# Altium schematic sheet Sheet1.SchDoc
size B; SheetNumber: 1; SheetTotal: 2
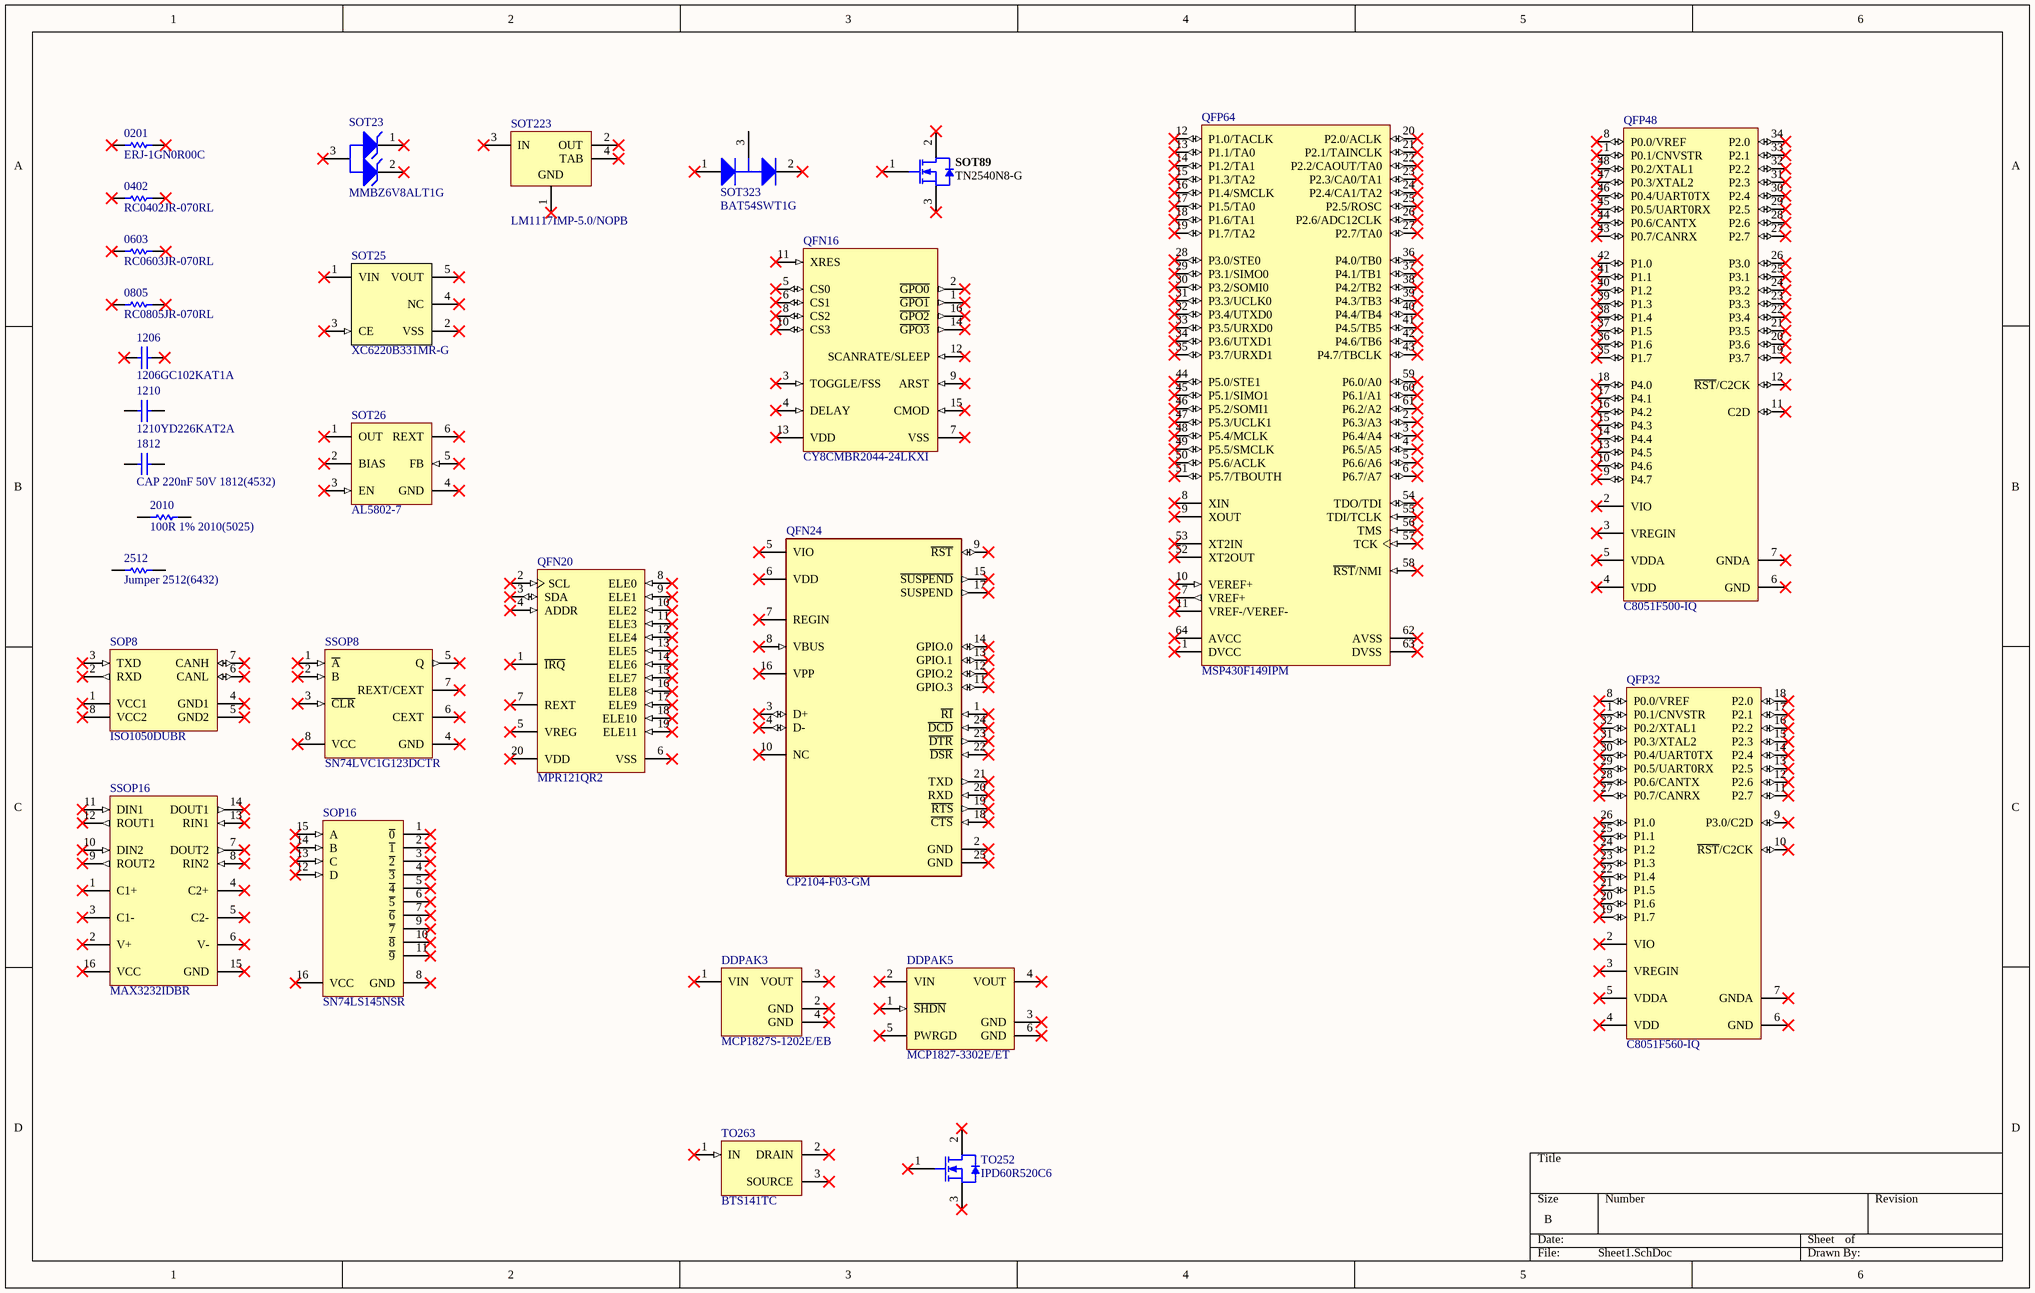
[diagram p0: Sheet1.SchDoc]

## Parts
0201  ERJ-1GN0R00C  [RESC0603X26X15LL03T05]
0402  RC0402JR-070RL  [RESC1005X40X25NL05T10]
0603  RC0603JR-070RL  [RESC1608X55X25ML10T15]
0805  RC0805JR-070RL  [RESC2013X60X35ML10T20]
1206  1206GC102KAT1A  [AVX-1206-2_L]
1210  1210YD226KAT2A  [CAPC3225X279X50LL20T25]
1812  CAP 220nF 50V 1812(4532)  [CAPC1812(4532)190_N]
2010  100R 1% 2010(5025)  [RESC2010(5025)_N]
2512  Jumper 2512(6432)  [RESC2512(6432)_L]
DDPAK3  MCP1827S-1202E/EB  [DDPAK-EB3_M]
DDPAK5  MCP1827-3302E/ET  [DDPAK-ET5_M]
QFN16  CY8CMBR2044-24LKXI  [CYP-LKX16_L]
QFN20  MPR121QR2  [FREE-QFN-20_L]
QFN24  CP2104-F03-GM  [FP-CP2104-F03-GM-MFG]
QFP32  C8051F560-IQ  [LQFP-32_L]
QFP48  C8051F500-IQ  [QFP-48_M]
QFP64  MSP430F149IPM  [PM0064A_M]
SOP8  ISO1050DUBR  [DUB0008A_L]
SOP16  SN74LS145NSR  [NS0016A_M]
SOT23  MMBZ6V8ALT1G  [ONSC-SOT-23-3-318-08_V]
SOT25  XC6220B331MR-G  [TORX-SOT-25-5_M]
SOT26  AL5802-7  [DIOD-SOT26-6_V]
SOT89  TN2540N8-G  [MCHP-TO-243AA_N8_L]
SOT223  LM1117IMP-5.0/NOPB  [DCY0004A_M]
SOT323  BAT54SWT1G  [ONSC-SOT-323-3-419-04_V]
SSOP8  SN74LVC1G123DCTR  [DCT0008A_N]
SSOP16  MAX3232IDBR  [DB0016A_M]
TO252  IPD60R520C6  [INF-PG-TO252-3-313_M]
TO263  BTS141TC  [INF-PG-TO263-3-2_L]

## Nets

Not connected (* = marked no-connect by the designer): 0201 1* 2*; 0402 1* 2*; 0603 1* 2*; 0805 1* 2*; 1206 1* 2*; 1210 1 2; 1812 1 2; 2010 1 2; 2512 1 2; DDPAK3 1(VIN)* 2(GND)* 3(VOUT)* 4(GND)*; DDPAK5 1(~{SHDN})* 2(VIN)* 3(GND)* 4(VOUT)* 5(PWRGD)* 6(GND)*; QFN16 1(~{GPO1})* 2(~{GPO0})* 3(TOGGLE/FSS)* 4(DELAY)* 5(CS0)* 6(CS1)* 7(VSS)* 8(CS2)* 9(ARST)* 10(CS3)* 11(XRES)* 12(SCANRATE/SLEEP)* 13(VDD)* 14(~{GPO3})* 15(CMOD)* 16(~{GPO2})*; QFN20 1(~{IRQ})* 2(SCL)* 3(SDA)* 4(ADDR)* 5(VREG)* 6(VSS)* 7(REXT)* 8(ELE0)* 9(ELE1)* 10(ELE2)* 11(ELE3)* 12(ELE4)* 13(ELE5)* 14(ELE6)* 15(ELE7)* 16(ELE8)* 17(ELE9)* 18(ELE10)* 19(ELE11)* 20(VDD)*; QFN24 1(~{RI})* 2(GND)* 3(D+)* 4(D-)* 5(VIO)* 6(VDD)* 7(REGIN)* 8(VBUS)* 9(~{RST})* 10(NC)* 11(GPIO.3)* 12(GPIO.2)* 13(GPIO.1)* 14(GPIO.0)* 15(~{SUSPEND})* 16(VPP)* 17(SUSPEND)* 18(~{CTS})* 19(~{RTS})* 20(RXD)* 21(TXD)* 22(~{DSR})* 23(~{DTR})* 24(~{DCD})* 25(GND)*; QFP32 1(P0.1/CNVSTR)* 2(VIO)* 3(VREGIN)* 4(VDD)* 5(VDDA)* 6(GND)* 7(GNDA)* 8(P0.0/VREF)* 9(P3.0/C2D)* 10(~{RST}/C2CK)* 11(P2.7)* 12(P2.6)* 13(P2.5)* 14(P2.4)* 15(P2.3)* 16(P2.2)* 17(P2.1)* 18(P2.0)* 19(P1.7)* 20(P1.6)* 21(P1.5)* 22(P1.4)* 23(P1.3)* 24(P1.2)* 25(P1.1)* 26(P1.0)* 27(P0.7/CANRX)* 28(P0.6/CANTX)* 29(P0.5/UART0RX)* 30(P0.4/UART0TX)* 31(P0.3/XTAL2)* 32(P0.2/XTAL1)*; QFP48 1(P0.1/CNVSTR)* 2(VIO)* 3(VREGIN)* 4(VDD)* 5(VDDA)* 6(GND)* 7(GNDA)* 8(P0.0/VREF)* 9(P4.7)* 10(P4.6)* 11(C2D)* 12(~{RST}/C2CK)* 13(P4.5)* 14(P4.4)* 15(P4.3)* 16(P4.2)* 17(P4.1)* 18(P4.0)* 19(P3.7)* 20(P3.6)* 21(P3.5)* 22(P3.4)* 23(P3.3)* 24(P3.2)* 25(P3.1)* 26(P3.0)* 27(P2.7)* 28(P2.6)* 29(P2.5)* 30(P2.4)* 31(P2.3)* 32(P2.2)* 33(P2.1)* 34(P2.0)* 35(P1.7)* 36(P1.6)* 37(P1.5)* 38(P1.4)* 39(P1.3)* 40(P1.2)* 41(P1.1)* 42(P1.0)* 43(P0.7/CANRX)* 44(P0.6/CANTX)* 45(P0.5/UART0RX)* 46(P0.4/UART0TX)* 47(P0.3/XTAL2)* 48(P0.2/XTAL1)*; QFP64 1(DVCC)* 2(P6.3/A3)* 3(P6.4/A4)* 4(P6.5/A5)* 5(P6.6/A6)* 6(P6.7/A7)* 7(VREF+)* 8(XIN)* 9(XOUT)* 10(VEREF+)* 11(VREF-/VEREF-)* 12(P1.0/TACLK)* 13(P1.1/TA0)* 14(P1.2/TA1)* 15(P1.3/TA2)* 16(P1.4/SMCLK)* 17(P1.5/TA0)* 18(P1.6/TA1)* 19(P1.7/TA2)* 20(P2.0/ACLK)* 21(P2.1/TAINCLK)* 22(P2.2/CAOUT/TA0)* 23(P2.3/CA0/TA1)* 24(P2.4/CA1/TA2)* 25(P2.5/ROSC)* 26(P2.6/ADC12CLK)* 27(P2.7/TA0)* 28(P3.0/STE0)* 29(P3.1/SIMO0)* 30(P3.2/SOMI0)* 31(P3.3/UCLK0)* 32(P3.4/UTXD0)* 33(P3.5/URXD0)* 34(P3.6/UTXD1)* 35(P3.7/URXD1)* 36(P4.0/TB0)* 37(P4.1/TB1)* 38(P4.2/TB2)* 39(P4.3/TB3)* 40(P4.4/TB4)* 41(P4.5/TB5)* 42(P4.6/TB6)* 43(P4.7/TBCLK)* 44(P5.0/STE1)* 45(P5.1/SIMO1)* 46(P5.2/SOMI1)* 47(P5.3/UCLK1)* 48(P5.4/MCLK)* 49(P5.5/SMCLK)* 50(P5.6/ACLK)* 51(P5.7/TBOUTH)* 52(XT2OUT)* 53(XT2IN)* 54(TDO/TDI)* 55(TDI/TCLK)* 56(TMS)* 57(TCK)* 58(~{RST}/NMI)* 59(P6.0/A0)* 60(P6.1/A1)* 61(P6.2/A2)* 62(AVSS)* 63(DVSS)* 64(AVCC)*; SOP8 1(VCC1)* 2(RXD)* 3(TXD)* 4(GND1)* 5(GND2)* 6(CANL)* 7(CANH)* 8(VCC2)*; SOP16 1(~{0})* 2(~{1})* 3(~{2})* 4(~{3})* 5(~{4})* 6(~{5})* 7(~{6})* 8(GND)* 9(~{7})* 10(~{8})* 11(~{9})* 12(D)* 13(C)* 14(B)* 15(A)* 16(VCC)*; SOT23 1(K1)* 2(K2)* 3(A)*; SOT25 1(VIN)* 2(VSS)* 3(CE)* 4(NC)* 5(VOUT)*; SOT26 1(OUT)* 2(BIAS)* 3(EN)* 4(GND)* 5(FB)* 6(REXT)*; SOT89 1(G)* 2(D)* 3(S)*; SOT223 1(GND)* 2(OUT)* 3(IN)* 4(TAB)*; SOT323 1(A)* 2(K)* 3(K/A); SSOP8 1(~{A})* 2(B)* 3(~{CLR})* 4(GND)* 5(Q)* 6(CEXT)* 7(REXT/CEXT)* 8(VCC)*; SSOP16 1(C1+)* 2(V+)* 3(C1-)* 4(C2+)* 5(C2-)* 6(V-)* 7(DOUT2)* 8(RIN2)* 9(ROUT2)* 10(DIN2)* 11(DIN1)* 12(ROUT1)* 13(RIN1)* 14(DOUT1)* 15(GND)* 16(VCC)*; TO252 1(GATE)* 2(DRAIN)* 3(SOURCE)*; TO263 1(IN)* 2(DRAIN)* 3(SOURCE)*

## Library data of the parts
0201 = CMP-1010-00001-2: Manufacturer: Panasonic; Part Number: ERJ-1GN0R00C
0402 = CMP-1011-00001-2: Manufacturer: Yageo / Phycomp; Part Number: RC0402JR-070RL
0603 = CMP-2100-03667-1: Chip Resistor, 0 Ohm, +/- 5%, 0.1 W, -55 to 155 degC, 0603 (1608 Metric), RoHS, Tape and Reel; Manufacturer: Yageo; Temperature Coefficient: 200ppm/degreesC; Voltage Rating: 50V; Power Rating: 100mW; Resistance: 0mOhm; Width: 0.8mm; Max Operating Temperature: 155degC; Tolerance: 5%; Package Reference: 0603; Height: 0.45mm; Depth: 0.8mm; Package Description: 2-Pin Surface Mount Device, Body 1.6 x 0.8 mm; Termination: SMD/SMT; Package Quantity: 5000; Case/Package: 0603; Case Code (Imperial): 0603; Radiation Hardening: No; Number of Pins: 2; Length: 1.6mm; Lead Free: LeadFree; Voltage Rating (DC): 50V; Military Standard: Not; Datasheet URL: http://www.yageo.com/NewPortal/yageodocoutput?fileName=/pdf/R-Chip/PYu-RC_Group_51_RoHS_L_5.pdf; Manufacturer URL: http://www.yageo.com/; Packaging: TapeandReel; Case Code (Metric): 1608; Min Operating Temperature: -55degC; Composition: ThickFilm; RoHSCompliant: true; Contact Plating: Tin; Datasheet Version: Rev. 5, 10/2016; REACH SVHC: NoSVHC
0805 = CMP-2100-03673-1: Chip Resistor, 0 Ohm, Jumper, +/- 5%, 0.125 W, -55 to 155 degC, 0805 (2012 Metric), RoHS, Tape and Reel; Manufacturer: Yageo; Power Rating: 125mW; Resistance: 0mOhm; Voltage Rating (DC): 150V; Temperature Coefficient: 200ppm/degreesC; Height: 0.5mm; Depth: 1.25mm; Case Code (Imperial): 0805; Lead Free: LeadFree; Military Standard: Not; Package Description: 2-Pin Surface Mounted Device, Body 2 x 1.25 mm; Case Code (Metric): 2012; Composition: ThickFilm; Voltage Rating: 150V; Manufacturer URL: http://www.yageo.com/; Packaging: TapeandReel; Package Reference: 0805; REACH SVHC: Unknown; Tolerance: 5%; Case/Package: 0805; Max Operating Temperature: 155degC; Number of Pins: 2; Min Operating Temperature: -55degC; RoHSCompliant: true; Length: 2mm; Datasheet URL: http://www.yageo.com/NewPortal/yageodocoutput?fileName=/pdf/R-Chip/PYu-RC_Group_51_RoHS_L_5.pdf; Termination: SMD/SMT; Radiation Hardening: No; Width: 1.25mm; Contact Plating: Tin; Datasheet Version: Rev. 5, 10/2016
1206 = CMP-2000-05468-1: Chip Capacitor, 1 nF, +/- 10%, -55 to 125 degC, 1206 (3216 Metric), RoHS, Tape and Reel; Manufacturer: AVX; Capacitance: 0.001uF; Dielectric: X7R; Voltage Rating DC: 2000V; Package Reference: 1206; Datasheet Version: 11/2010; Mounting Technology: SurfaceMount; Manufacturer URL: http://www.avx.com/; Tolerance: 10%; Tolerance (%): ±10%; PartNumber: 1206GC102KAT1A; Datasheet URL: https://datasheet.ciiva.com/11787/0900766b80ed4c37-11787781.pdf; Package Description: 2-Pin SMD, Body 3.4 x 1.8 mm; Case Size/Dimension: 1206; Rated Voltage: 2000V
1210 = CMP-2000-05483-1: Chip Capacitor, 22 uF, +/- 10%, 16 V, -55 to 85 degC, 1210 (3225 Metric), RoHS, Tape and Reel; Manufacturer: AVX; Rated Voltage: 16V; Dielectric: X5R; Capacitance: 22µF; Tolerance (%): ±10%; Datasheet Version: 05/2016; Case Size/Dimension: 1210; Package Reference: 1210; Package Description: 2-Pin Surface Mount Device, Body 3.2 x 2.5 mm; Mounting Technology: SurfaceMount; Manufacturer URL: http://www.avx.com/; Datasheet URL: http://datasheets.avx.com/cx5r.pdf
1812 = CMP-1040-01438-1: CAP 220nF 50V ±10% 1812 (4532 Metric) Thickness 1.9mm SMD; Tolerance: Â±10%; Case-Metric: 4532; Case-EIA: 1812; Max Thickness: 1.9 mm; Technology: SMT; Value: 220nF; Rated Voltage: 50 V
2010 = CMP-1017-00397-1: 100R 0.75W 1% 2010 (5025 Metric)  SMD; Case-EIA: 2010; Case-Metric: 5025; Value: 100.00 Ohm; Tolerance: 1 %; Power: 0.75 W; Technology: SMT
2512 = CMP-1018-00001-1: Jumper 2512 (6432 Metric); Tolerance: None; Case-EIA: 2512; Value: 0.00 Ohm; Case-Metric: 6432; Technology: SMT; Power: None
DDPAK3 = CMP-0136-00060-1: 1.5A, Low Voltage, Low Quiescent Current LDO Regulator, 3-Pin DDPAK, Extended Temperature; PackageDescription: 3-Lead Plastic (EB) [DDPAK]; PackageReference: DDPAK-EB3; PackageVersion: revBB, Aug-2009; DatasheetVersion: revC, Feb-2007
DDPAK5 = CMP-0136-00037-1: 1.5A, Low Voltage, Low Quiescent Current LDO Regulator, 5-Pin DDPAK, Extended Temperature; PackageDescription: 5-Lead Plastic (ET) [DDPAK]; DatasheetVersion: revC, Feb-2007; PackageVersion: revBB, Aug-2009; PackageReference: DDPAK-ET5
QFN16 = CMP-0374-00015-2: Four Button CapSense Controller, 4 CapSense IO, 1.71 to 5.50 V, 16-Pin QFN (LKX16); Manufacturer: Cypress; Comm. Interface: GPO; Min. Operating Voltage (V): 1.71; Rating: I; No. of GPIOs: 4; Proximity Sensing: N; SmartSense Enabled: Y; Packing: Tray; Max. Operating Voltage (V): 5.5; Code_JEDEC: MO-220; PackageReference: LKX16; ComponentLink2URL: http://www.cypress.com/?docID=45011; PackageVersion: *E; ComponentLink4URL: http://www.cypress.com/?rID=45569; Mounting Technology: Surface Mount; ComponentLink1URL: http://www.cypress.com/; DatasheetVersion: Rev. *G; ComponentLink1Description: Manufacturer URL; Min. Operating Temp. (Â°C): -40; No. of CapSense IO: 4; ComponentLink4Description: Product URL; ComponentLink3URL: http://www.cypress.com/?docID=39689; PWMs: N; Max. Operating Temp. (Â°C): 85; RoHS: Pb-Free; PartNumber: CY8CMBR2044-24LKXI; PackageDescription: 16-Pin Chip on Lead Sawn QFN, Body 3 X 3 mm, Pitch 0.5 mm; ComponentLink2Description: Datasheet; ComponentLink3Description: Package Specification
QFN20 = CMP-1750-00004-1: Proximity Capacitive Touch Sensor Controller, 1.71 to 3.6 V, -40 to 85 degC, 20-Pin QFN, RoHS, Tape and Reel; Current Rating: 2 A; Voltage Rating: 750 V; PackageDescription: 20-Pin Quad Flat No-lead Package, Body 3 x 3 mm, Pitch 0.4 mm; ComponentLink1URL: http://www.nxp.com/; Radiation Hardening: No; RoHSCompliant: True; Package Quantity: 22; Height: 8.64 mm; Min Operating Temperature: -65degC; Max Operating Temperature: 105degC; Mount: Through Hole; ComponentLink1Description: Manufacturer URL; Lead Pitch: 2.54 mm; Width: 3.56 mm; DatasheetVersion: Rev. 4, 02/2013; Length: 25.4 mm; Colour: Black; Pins: 10; Contact Finish: Gold; ComponentLink2Description: Datasheet; Packaging: Rail/Tube; Contact Plating: Gold; ComponentLink2URL: http://www.nxp.com/files/sensors/doc/data_sheet/MPR121.pdf; PackageReference: QFN-20; Contact Material: Bronze
QFN24 = CMP-0511-00004-2: IC SGL USB-TO-UART BRIDGE 24QFN; Number of Transceivers: 1; Max Supply Voltage: 3.6V; Operating Supply Current: 17mA; Operating Supply Voltage: 3.3V; Data Rate: 2Mbps; Min Supply Voltage: 3V; Number of Channels: 1; Max Operating Temperature: 85°C; Contact Plating: Tin; Min Operating Temperature: -40°C; Number of Pins: 24; Case/Package: QFN; Packaging: Rail/Tube; Radiation Hardening: No; Weight: 0.001764oz
QFP32 = CMP-0230-00164-1: Mixed Signal 32KB Flash ISP MCU, 2304B RAM, 25 I/Os, 12-Bit 25 Channel ADC, CAN 2.0, LIN 2.1, 32-Pin QFP, Industrial Grade; PackageVersion: 2007; ComponentLink2URL: http://www.silabs.com/Support%20Documents/TechnicalDocs/C8051F55x-F56x-F57x.pdf; ComponentLink2Description: Datasheet; DatasheetVersion: rev1.1, 2011; ComponentLink1Description: Manufacturer Link; PackageDescription: 32-Pin Thin Quad Flat Pack, 7 x 7 x 1.4 mm Body, 0.8 mm Pitch; PackageReference: LQFP-32; ComponentLink1URL: http://www.silabs.com
QFP48 = CMP-0230-00134-1: Mixed Signal 64KB ISP Flash MCU, 4352B RAM, 40 I/Os, 12-Bit 32 Channel ADC, Can 2.0B, LIN 2.0, Ext Mem, 48-Pin QFP, Industrial Grade; Code_JEDEC: MS-026-ABC; DatasheetVersion: rev1.2, Mar-2011; ComponentLink1Description: Manufacturer Link; ComponentLink1URL: http://www.silabs.com; ComponentLink2Description: Datasheet; PackageDescription: 48-Pin Thin Quad Flat Pack, 7 x 7 x 1 mm Body, 0.5 mm Pitch; ComponentLink2URL: http://www.silabs.com/Support%20Documents/TechnicalDocs/C8051F50x-51x.pdf; PackageReference: QFP-48; PackageVersion: 2011
QFP64 = CMP-0365-00282-2: 8 MHz Mixed Signal Microcontroller with 60 KB Flash, 2048 B SRAM and 48 GPIOs, -40 to 85 degC, 64-pin QFP (PM), Green (RoHS & no Sb/Br); Manufacturer: Texas Instruments; USART: 2; SubFamily: 1 Series; ADC: 12-bit SAR; SRAM(B): 2048; Frequency(MHz): 8; GPIO: 48; Flash(KB): 60; Watchdog: Yes; Multiplier: 16x16; PackageDescription: 64-Pin Plastic Quad Flat Pack, Body 10 x 10 mm, Pitch 0.5 mm; Eco-Plan: Green (RoHS & no Sb/Br); ComponentLink1URL: http://www.ti.com/; PartNumber: MSP430F149IPM; ComponentLink3URL: http://www.ti.com/lit/ml/mtqf008a/mtqf008a.pdf; ComponentLink1Description: Manufacturer URL; ComponentLink2URL: http://www.ti.com/general/docs/lit/getliterature.tsp?genericPartNumber=MSP430F149&fileType=pdf; Mounting Technology: Surface Mount; ADC Channels: 8; Timers - 16-bit: 2; DatasheetVersion: SLAS272F; Code_JEDEC: MS-026; PackageReference: PM0064A; Comparators: Yes; ComponentLink2Description: Datasheet; Temp Sensor: Yes; PackageVersion: 4040152/C; ComponentLink3Description: Package Specification
SOP8 = CMP-0315-00093-2: Isolated CAN Transceiver, -55 to 105 degC, 8-pin SOP (DUB), Green (RoHS & no Sb/Br); Manufacturer: Texas Instruments; Rating: Catalog; Isolated: Yes; Drivers Per Package: 1; PackageReference: DUB0008A; PartNumber: ISO1050DUBR; ComponentLink2Description: Package Specification; ComponentLink1Description: Datasheet; Mounting Technology: Surface Mount; ComponentLink1URL: http://www.ti.com/general/docs/lit/getliterature.tsp?genericPartNumber=ISO1050&fileType=pdf; ComponentLink2URL: http://www.ti.com/litv/pdf/mpds247b; Eco-Plan: Green (RoHS & no Sb/Br); PackageDescription: 8-Pin Small Outline Package 2.54 mm Pitch; PackageVersion: revC, May-2006; SubFamily: CAN; DatasheetVersion: SLLS983E
SOP16 = CMP-1633-00758-2: BCD-To-Decimal Decoders/Drivers, NS0016A, LARGE T&R; Manufacturer: Texas Instruments; VCC(Min)(V): 4.75; VCC(Max)(V): 5.25; Function: Decoder/Demultiplexer; F @ Nom Voltage(Max)(Mhz): 35; Rating: Catalog; Configuration: 4：10; ICC @ Nom Voltage(Max)(mA): 13; tpd @ Nom Voltage(Max)(ns): 50; Voltage(Nom)(V): 5; Output Drive (IOL/IOH)(Max)(mA): 80/-20; Input Type: TTL; Schmitt Trigger: No; Bits(#): 10; Channels(#): 1; Technology Family: LS; Type: Standard; PackageReference: NS0016A; DatasheetVersion: SDLS051; Operating Temperature Range(C): 0 to 70; Generic Part Number: SN74LS145; Output Type: TTL
SOT23 = CMP-1061-00654-1: 40 W Peak Power Zener Transient Voltage Suppressor, Dual Common Anode Zeners for ESD Protection, 3-Pin SOT-23, Pb-Free, Tape and Reel; Manufacturer: On Semiconductor; V(BR) Typ (V): 6.8; IR Max (uA): 0.5; PPK Max (W): 24; Direction: Unidirectional; PartNumber: MMBZ6V8ALT1G; PackageReference: SOT-23-3-318-08; RoHS: Pb-Free; ComponentLink2URL: http://www.onsemi.com/pub_link/Collateral/MMBZ5V6ALT1-D.PDF; PackageVersion: Rev. AP, 11/2009; DatasheetVersion: Rev. 13; Packing: Tape and Reel; ComponentLink3Description: Package Specification; ComponentLink3URL: http://www.onsemi.cn/pub_link/Collateral/318-08.PDF; ComponentLink1URL: http://www.onsemi.com/; Mounting Technology: Surface Mount; ComponentLink1Description: Manufacturer URL; PackageDescription: 3-Pin Small Outline Transistor, Body 2.92 x 1.3 mm, Pitch 0.95 mm; ComponentLink2Description: Datasheet
SOT25 = CMP-0599-00001-2: 1A LDO Voltage Regulator with CL discharge, 3.3 V, 1000 mA, -45 to 85 degC, 5-Pin SOT-25, RoHS, Reel; Manufacturer: Torex; Output Voltage: 3.3 V; Maximum Output Current: 1000 mA; ComponentLink1Description: Manufacturer URL; ComponentLink2URL: http://www.torex.co.jp/english/products/voltage_regulators/data/XC6220.pdf; DatasheetVersion: ETR0341-010a; ComponentLink1URL: http://www.torex.co.jp/; Mounting Technology: Surface Mount; Operating Ambient Temperature: -40 to 85 degC; PackageReference: SOT-25-5; PackageDescription: 5-Pin Small Out-Line Transistor, Body 2.9 x 1.65 mm, Pitch 0.95 mm; PartNumber: XC6220B331MR-G; RoHS: TRUE; Packing: Reel; ComponentLink2Description: Datasheet
SOT26 = CMP-2000-05770-1: Adjustable Current Sink Linear LED Driver, 30 V, -40 to 125 degC, 6-Pin SOT23 (SOT26), RoHS, Tape and Reel; Manufacturer: DiodesIncorporated; Input Voltage: 4.5Vto30V; Pd - Power Dissipation: 1W; Unit Weight: 0.001058oz; Datasheet Version: Rev. 6-2, 12/2012; Package Reference: SOT26-6; Brand: DiodesIncorporated; Factory Pack Quantity: 3000; Package Description: 6-Pin Small Outline Transistor, Body 1.6 x 3 mm, Pitch 0.95 mm; Manufacturer URL: http://www.diodes.com/; Datasheet URL: https://datasheet.ciiva.com/15224/getdatasheetpartid-661227-15224070.pdf; RoHS: True; Series: AL580; Mounting Style: SMD/SMT; Product Category: LEDLightingDrivers; Mounting Technology: SurfaceMount; Minimum Operating Temperature: -40C; Packaging: Reel; Maximum Operating Temperature: +125C; Package / Case: SOT-26
SOT89 = CMP-2000-07270-1: N-Channel Enhancement-Mode Vertical DMOS FET, 2 V, 1 A, 12 Ohm, -55 to 150 degC, 3-Pin SOT-89, RoHS, Tape and Reel; Manufacturer: Microchip; Transistor Type: 1N-Channel; Number of Channels: 1Channel; Typical Turn-Off Delay Time: 25ns; Configuration: Single; Rise Time: 15ns; Vds - Drain-Source Breakdown Voltage: 400V; Brand: MicrochipTechnology; Typical Turn-On Delay Time: 20ns; Vgs - Gate-Source Voltage: 20V; Pd - Power Dissipation: 1.6W; Id - Continuous Drain Current: 260mA; Unit Weight: 0.001862oz; Rds On - Drain-Source Resistance: 12Ohms; Product Category: MOSFET; Package Description: 3-Piin Small Outline Transistor, Body 4.5 x 2.445 mm, Pitch 1.5 mm; Package Reference: TO-243AA; Length: 4.6mm; Manufacturer URL: http://www.microchip.com/; Type: FET; Packaging: Reel; Minimum Operating Temperature: -55C; Transistor Polarity: N-Channel; Technology: Si; Mounting Style: SMD/SMT; RoHS: True; Mounting Technology: SurfaceMount; Height: 1.6mm; Maximum Operating Temperature: +150C; Fall Time: 15ns; Package / Case: SOT-89-3; Product: MOSFETSmallSignal; Datasheet URL: http://ww1.microchip.com/downloads/en/DeviceDoc/TN2540%20A062113.pdf; Factory Pack Quantity: 2000; Datasheet Version: 08/2013; Width: 2.6mm; Channel Mode: Enhancement
SOT223 = CMP-0062-01627-4: 800mA Low-Dropout Linear Regulator, 4-pin SOT-223, Pb-Free; Manufacturer: Texas Instruments; PackageTopMarking: XYTT*N06B; CompType: LDO IC; PowerWise: N; High-Reliability: Y; RoHS: Y; Code_JEDEC: TO-261-AA; ComponentLink1URL: http://www.ti.com/general/docs/lit/getliterature.tsp?genericPartNumber=LM1117-N&fileType=pdf; Code_IPC: SOT223-4; ComponentLink1Description: Datasheet URL; PartNumber: LM1117IMP-5.0/NOPB; PackageReference: DCY0004A; PinCount: 4; PackageDescription: Molded SOT-223, 6.50 x 3.56 x 1.6mm Body, 4 Lead, 2.3mm Pitch
SOT323 = CMP-1055-00559-1: Dual Series Schottky Barrier Diodes, 3-Pin SOT-323, Pb-Free, Tape and Reel; Manufacturer: On Semiconductor; trr Max (ns): 5; IFSM Max (A): 0.6; ComponentLink1URL: http://www.onsemi.com/; Mounting Technology: Surface Mount; ComponentLink1Description: Manufacturer URL; ComponentLink3URL: http://www.onsemi.com/pub_link/Collateral/419-04.PDF; RoHS: TRUE; PackageVersion: Rev. N, 11/2008; Packing: Tape and Reel; PackageReference: SOT-323-3-419-04; ComponentLink2URL: http://www.onsemi.cn/pub_link/Collateral/BAT54SWT1-D.PDF; ComponentLink3Description: Package Specification; PackageDescription: 3-Pin Small Outline Transistor, Body 2 x 1.25 mm, Pitch 0.65 mm; ComponentLink2Description: Datasheet; PartNumber: BAT54SWT1G; DatasheetVersion: Rev. 10; Configuration: Dual
SSOP8 = CMP-0859-00566-3: Single Retriggerable Monostable Multivibrator with Schmitt-Trigger Inputs, DCT0008A, LARGE T&R; Manufacturer: Texas Instruments; Technology Family: LVC; ICC @ Nom Voltage(Max)(mA): 0.02; tpd @ Nom Voltage(Max)(ns): 34,11,8,5.5; Logic: True; Input Type: CMOS/TTL; Voltage(Nom)(V): 1.8,2.5,3.3,5; Output Type: CMOS; Bits(#): 1; VCC(Min)(V): 1.65; 3-State Output: No; VCC(Max)(V): 5.5; Schmitt Trigger: Yes; Output Drive (IOL/IOH)(Max)(mA): 32/-32; F @ Nom Voltage(Max)(Mhz): 150; Rating: Catalog; DatasheetVersion: SCES586C; Operating Temperature Range(C): -40 to 125,-40 to 85; Generic Part Number: SN74LVC1G123; Sub-Family: Monostable Multivibrator; PackageReference: DCT0008A; Specialty Logic Family: Monostable Multivibrator
SSOP16 = CMP-0299-01189-2: 3-V to 5.5-V Multichannel RS-232 Line Driver / Receiver with ±15-kV ESD Protection, -40 to 85 degC, 16-Pin SSOP (DB), Green (RoHS & no Sb/Br); Drivers Per Package: 2; Supply Voltage(s)(V): 3.3 or 5.0; Single Supply: TRUE; ICC(Max)(mA): 1; ESD HBM(kV): +/-15; ComponentLink3Description: Package Specification; Receivers Per Package: 2; SubFamily: RS-232; ComponentLink3URL: http://www.ti.com/litv/pdf/msso002e; ComponentLink1Description: Manufacturer URL; ComponentLink2URL: http://www.ti.com/general/docs/lit/getliterature.tsp?genericPartNumber=MAX3232&fileType=pdf; ComponentLink1URL: www.ti.com; RS-232: TRUE; ComponentLink2Description: Datasheet; PackageReference: DB0016A; PackageDescription: 16-Pin Plastic Small Outline Package, 6.2 x 5.3 mm Body, 0.65 mm Pitch; DatasheetVersion: SLLS410I; PackageVersion: revE, Dec-2001
TO252 = CMP-1164-00353-1: N-Channel CoolMOS C6 Power-Transistor, 600 V VDS, 8.1 A ID, -55 to 150 degC, PG-TO252-3-313, Reel, Green; Manufacturer: Infineon; QG: 23.4Â nC; VGS(th) (max): 3.5Â V; Green: TRUE; Ptot (max): 66Â W; Polarity: N; RthJC (max): 1.9Â K/W; ID (max): 8.1Â A; VDS (max): 600Â V; RDS (on) (max): 520Â mOhm; RthJA (max): 62Â K/W; IDpuls (max): 22Â A; VGS(th) (min): 2.5Â V; PackageVersion: Oct-10; Packing: Reel; PackageReference: PG-TO252-3-313; Mounting Technology: Surface Mount; ComponentLink1URL: http://www.infineon.com/; ComponentLink3Description: Package Specification; ComponentLink2Description: Datasheet; Rth: 1.9Â K/W; ComponentLink3URL: http://www.infineon.com/dgdl/PG-TO252-3-313-Package_Overview.pdf?folderId=db3a30432b57a660012b81890ade72d2&fileId=db3a30432b57a660012b8193af2872eb; PackageDescription: 3-Pin Plastic (Green) Transistor Single Outline Package, 6.5 x 6.12 mm Body, 2.28 mm Pitch; Technology: CoolMOS C6; ComponentLink1Description: Manufacturer URL; DatasheetVersion: Rev. 2.0; ComponentLink2URL: http://www.infineon.com/dgdl/IPD60R520C6_2.0.pdf?folderId=db3a3043163797a6011638933eda014b&fileId=db3a304323b87bc20123e676d18358fb; PartNumber: IPD60R520C6
TO263 = CMP-1137-00039-1: Smart Low-Side Power Switch HITFET, 60 V VDS, 12 A ID, -40 to 150 degC, PG-TO263-3-2, Reel, Green; Manufacturer: Infineon; ID(lim) (min): 25 A; ISC (max): 100 A; ID(nom): 5.1 A; VDS (max): 60 V; RDS (on)(max): 30 mOhm; Ptot (max): 149 mW; ID: 12 A; ton (max): 100 us; Channels: 1; toff (max): 170 us; Green: TRUE; PackageDescription: 3-Pin Plastic (Green) Transistor Single Outline Package, 10 x 9.25 mm Body, 2.54 mm Pitch; Packing: Reel; PackageVersion: Jul-09; ComponentLink3URL: http://www.infineon.com/dgdl/BTS141TC_DS_10.pdf?folderId=db3a3043163797a6011667aa084c0e01&fileId=db3a3043242ebc9e01242f43f58b003e&location=en.Products.Automotive_ICs.Smart_High-_and_Low-Side_Switches.HITFET___TEMPFET__-_Smart_Low-Side_Switches.DATASHEET.BT; Mounting Technology: Surface Mount; ComponentLink3Description: Package Specification; ComponentLink2URL: http://www.infineon.com/dgdl/BTS141TC_DS_10.pdf?folderId=db3a3043163797a6011667aa084c0e01&fileId=db3a3043242ebc9e01242f43f58b003e&location=en.Products.Automotive_ICs.Smart_High-_and_Low-Side_Switches.HITFET___TEMPFET__-_Smart_Low-Side_Switches.DATASHEET.BT; ComponentLink2Description: Datasheet; PackageReference: PG-TO263-3-2; PartNumber: BTS141TC; DatasheetVersion: Rev. 1.0; ComponentLink1Description: Manufacturer URL; Group: HITFET; ComponentLink1URL: http://www.infineon.com/; Halogen-free: FALSE